# Altium schematic sheet Fluid_Flow_FE.SchDoc
size A4; SheetNumber: 3; SheetTotal: 5
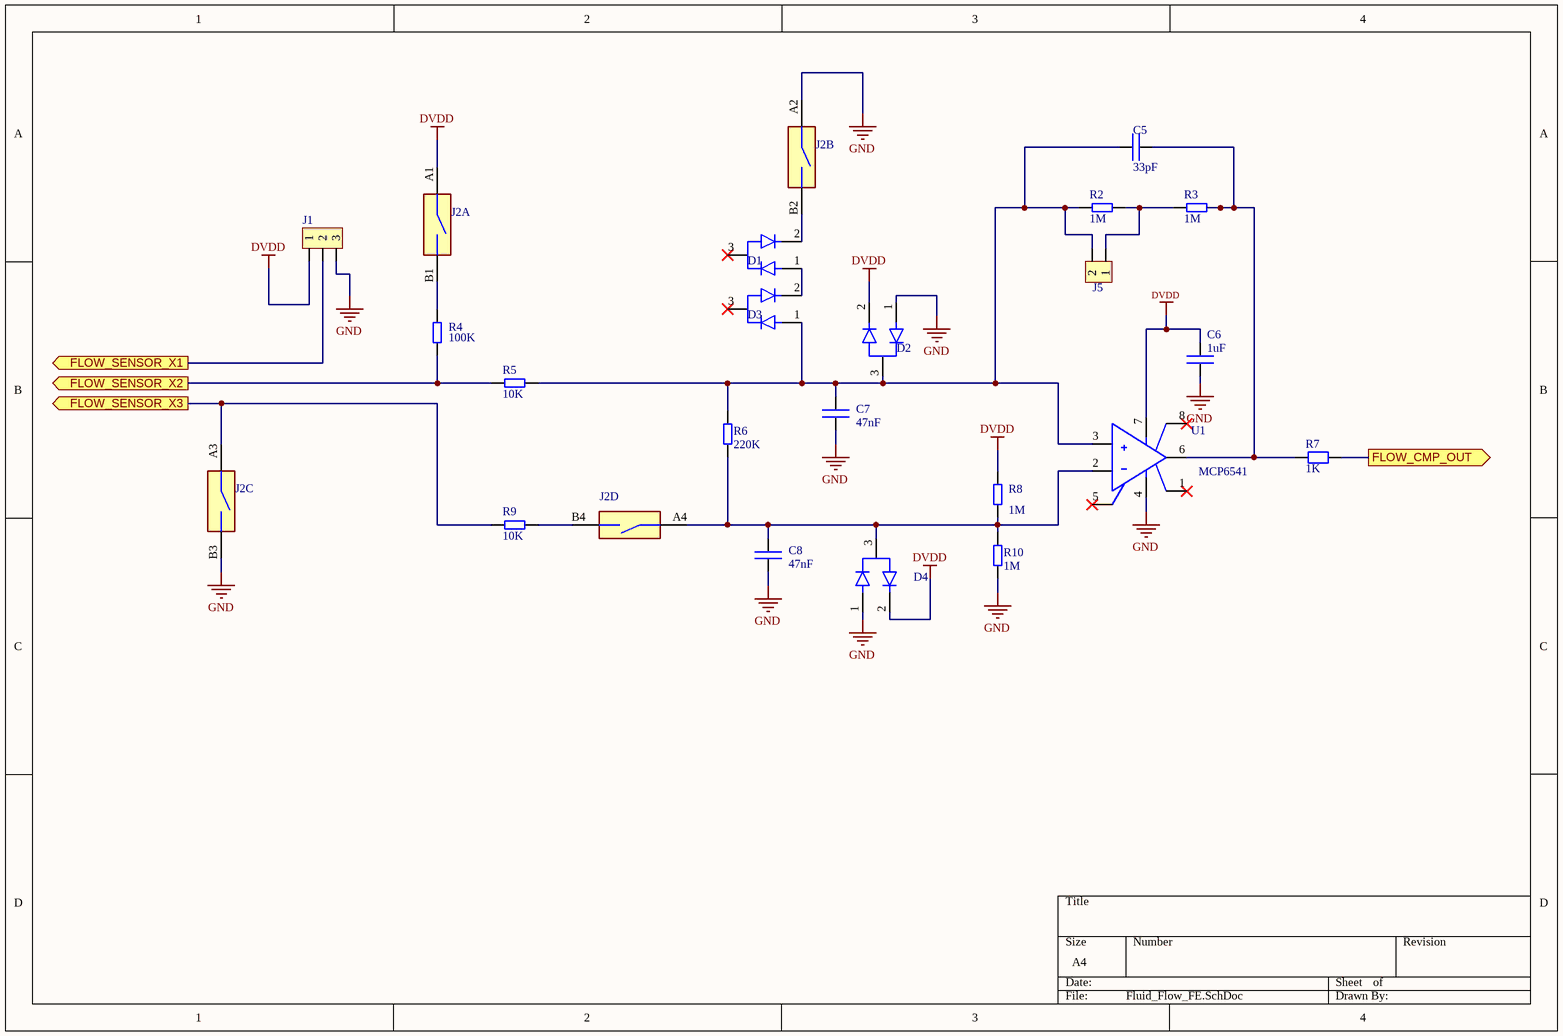
[diagram p0: Fluid_Flow_FE.SchDoc]

## Parts
C5  33pF  [CAP_SM0603_YAGEOCC2_N]
C6  1uF  [CAP_SM0603_YAGEOCC2_N]
C7  47nF  [CAP_SM0603_YAGEOCC2_N]
C8  47nF  [CAP_SM0603_YAGEOCC2_N]
D1  BAV23S  [BAV23S]  (value not drawn)
D2  BAV23S  [BAV23S]  (value not drawn)
D3  BAV23S  [BAV23S]  (value not drawn)
D4  BAV23S  [BAV23S]  (value not drawn)
J1  54101-T0600LF-CUT-3  [HEADER PIN 1X3]  (value not drawn)
J2  DSHP04TSGER_1  [DSHP04TSGER]  (value not drawn)  (parts A,B,C,D of 4)
J5  54101-T0600LF-CUT-2  [HEADER PIN 1X2]  (value not drawn)
R2  1M  [RES_SM0603_YAGEORC_N]
R3  1M  [RES_SM0603_YAGEORC_N]
R4  100K  [RES_SM0603_YAGEORC_N]
R5  10K  [RES_SM0603_YAGEORC_N]
R6  220K  [RES_SM0603_YAGEORC_N]
R7  1K  [RES_SM0603_YAGEORC_N]
R8  1M  [RES_SM0603_YAGEORC_N]
R9  10K  [RES_SM0603_YAGEORC_N]
R10  1M  [RES_SM0603_YAGEORC_N]
U1  MCP6541  [MCP6541-E/SN]

## Ports
FLOW_CMP_OUT (out), FLOW_SENSOR_X1 (out), FLOW_SENSOR_X2 (out), FLOW_SENSOR_X3 (out)

## Nets
DVDD: C6.1 D2.2 D4.2 J1.1 J2.A1 R8.2 U1.7(V+)
GND: C6.2 C7.2 C8.2 D2.1 D4.1 J1.3 J2.A2 J2.B3 R10.1 U1.4(V-)
FLOW_CMP_OUT: R7.2 ; port FLOW_CMP_OUT
FLOW_SENSOR_X1: J1.2 ; port FLOW_SENSOR_X1
FLOW_SENSOR_X2: R4.1 R5.1 ; port FLOW_SENSOR_X2
FLOW_SENSOR_X3: J2.A3 R9.1 ; port FLOW_SENSOR_X3
NetC5_1: C5.1 C7.1 D2.3 D3.1 J5.2 R2.1 R5.2 R6.2 U1.3(IN+)
NetC5_2: C5.2 R3.2 R7.1 U1.6(OUT)
NetC8_1: C8.1 D4.3 J2.A4 R6.1 R8.1 R10.2 U1.2(IN-)
NetD1_1: D1.1 D3.2
NetD1_2: D1.2 J2.B2
NetJ2_B1: J2.B1 R4.2
NetJ2_B4: J2.B4 R9.2
NetJ5_1: J5.1 R2.2 R3.1

Not connected (* = marked no-connect by the designer): D1 3*; D3 3*; U1 1(OS_NUL)* 5(OS_NUL)* 8(TAB)*

## Library data of the parts
C5 = CC0603JRNPO9BN330: CAP 33pF SM0603 NPO 50V YAGEO CC2; Tolerance (%): 5; Voltage Rating (Volts): 50; Category: Capacitor; Manufacturer: Yageo; Manufacturer Part Number: CC0603JRNPO9BN330; Package: 0603; Value: 33pF; Supplier Part Number 1: 722029; Supplier 1: Farnell; ComponentLink1URL: http://www.yageo.com; ComponentLink1Description: Manufacturer Website; Supplier 2: Digi-Key; Supplier Part Number 2: 311-1064-1-ND
C6 = CC0603KRX7R6BB105: CAP 1uF SM0603 X7R 10V YAGEO CC2; Tolerance (%): 5; Voltage Rating (Volts): 50; Category: Capacitor; Manufacturer: Yageo; Manufacturer Part Number: CC0603KRX7R6BB105; Package: 0603; Value: 1uF; ComponentLink1URL: http://www.yageo.com; ComponentLink1Description: Manufacturer Website; Datasheet: https://datasheet.lcsc.com/lcsc/2304140030_YAGEO-CC0603KRX7R6BB105_C113807.pdf
C7 C8 = CC0603JRX7R7BB473: CAP 47nF SM0603 X7R 16V YAGEO; Tolerance: 5; Category: Capacitor; Manufacturer: Yageo; Manufacturer Part Number: CC0603JRX7R7BB473; Package: 0603; Value: 47nF; ComponentLink1URL: http://www.yageo.com; ComponentLink1Description: Manufacturer Website
D1-D4 = BAV23S: DIODE ARRAY GP 250V 200MA SOT23; Manufacturer: onsemi; Manufacturer Part Number: BAV23S; Category: Diodo; Datasheet: https://www.onsemi.com/pdf/datasheet/bav23s-d.pdf; Temperature Max: 150; Temperature Min: -55
J1 = 54101-T0600LF-CUT-3: Pin header pitch 2.54 TH - cuttable 3 od 36 positions.; Manufacturer: Amphenol ICC; Fraction: 3/36; Manufacturer Part Number: 54101-T0600LF; Vendor: *; Vendor Part Number: *
J2 = DSHP04TSGER_1: DIP Switches / SIP Switches 4pos 0.025A 24VDC 1/2 Pitch; Manufacturer: Kangshen; Vendor Part Number: C3293144; Vendor: LCSC; Manufacturer Part Number: DSHP04TSGER
J5 = 54101-T0600LF-CUT-2: Pin header pitch 2.54 TH - cuttable 2 od 36 positions.; Manufacturer: Amphenol ICC; Fraction: 2/36; Manufacturer Part Number: 54101-T0600LF; Vendor: *; Vendor Part Number: *
R2 R3 R8 R10 = RC0603FR-071ML: RES 1M SM0603 YAGEO RC_L; Power (Watts): 0.1; Resistance (Ohms): 1000000; Tolerance (%): 1; Category: Resistor; Manufacturer: Yageo; Manufacturer Part Number: RC0603FR-071ML; Package: 0603; Value: 1M; Supplier Part Number 1: 9238840; Supplier 1: Farnell; ComponentLink1URL: http://www.yageo.com; ComponentLink1Description: Manufacturer Website; Supplier 2: Digi-Key; Supplier Part Number 2: 311-1.00MHRCT-ND; Datasheet: https://www.yageo.com/upload/media/product/productsearch/datasheet/rchip/PYu-RC_Group_51_RoHS_L_12.pdf
R4 = RC0603FR-13100KL: RES 100K SM0603 YAGEO RC_L; Power (Watts): 0.1; Resistance (Ohms): 100000; Tolerance (%): 1; Category: Resistor; Manufacturer: Yageo; Manufacturer Part Number: RC0603FR-13100KL; Package: 0603; Value: 100K; Supplier Part Number 1: 2309107; Supplier 1: Farnell; ComponentLink1Description: Manufacturer Website; ComponentLink1URL: http://www.yageo.com; Supplier 2: Digi-Key
R5 R9 = RC0603FR-0710KL: RES 10K SM0603 YAGEO RC_L; Power (Watts): 0.1; Resistance (Ohms): 10000; Tolerance (%): 1; Category: Resistor; Manufacturer: Yageo; Manufacturer Part Number: RC0603FR-0710KL; Package: 0603; Value: 10K; Supplier Part Number 1: 9238603; Supplier 1: Farnell; ComponentLink1Description: Manufacturer Website; ComponentLink1URL: http://www.yageo.com; Supplier 2: Digi-Key; Supplier Part Number 2: 311-10.0KHRCT-ND
R6 = RC0603FR-07220KL: RES 220K SM0603 YAGEO RC_L; Power (Watts): 0.1; Resistance (Ohms): 220000; Tolerance (%): 1; Category: Resistor; Manufacturer: Yageo; Manufacturer Part Number: RC0603FR-07220KL; Package: 0603; Value: 220K; Supplier Part Number 1: 9238760; Supplier 1: Farnell; ComponentLink1Description: Manufacturer Website; ComponentLink1URL: http://www.yageo.com; Supplier 2: Digi-Key; Supplier Part Number 2: 311-220KHRCT-ND
R7 = RC0603FR-071KL: RES 1K SM0603 YAGEO RC_L; Power (Watts): 0.1; Resistance (Ohms): 1000; Tolerance (%): 1; Category: Resistor; Manufacturer: Yageo; Manufacturer Part Number: RC0603FR-071KL; Package: 0603; Value: 1K; Supplier Part Number 1: 9238484; Supplier 1: Farnell; ComponentLink1URL: http://www.yageo.com; ComponentLink1Description: Manufacturer Website; Supplier 2: Digi-Key; Supplier Part Number 2: 311-1.00KHRCT-ND
U1 = MCP6541-E/SN: IC COMP PP I/O SNGL 1.6V 8SOIC; Manufacturer: Microchip Tech; Manufacturer Part Number: MCP6541-E/SN